# Altium project EmbeddedControlSystem_Hengeveld4331.PrjPcb (part 2 of 2)
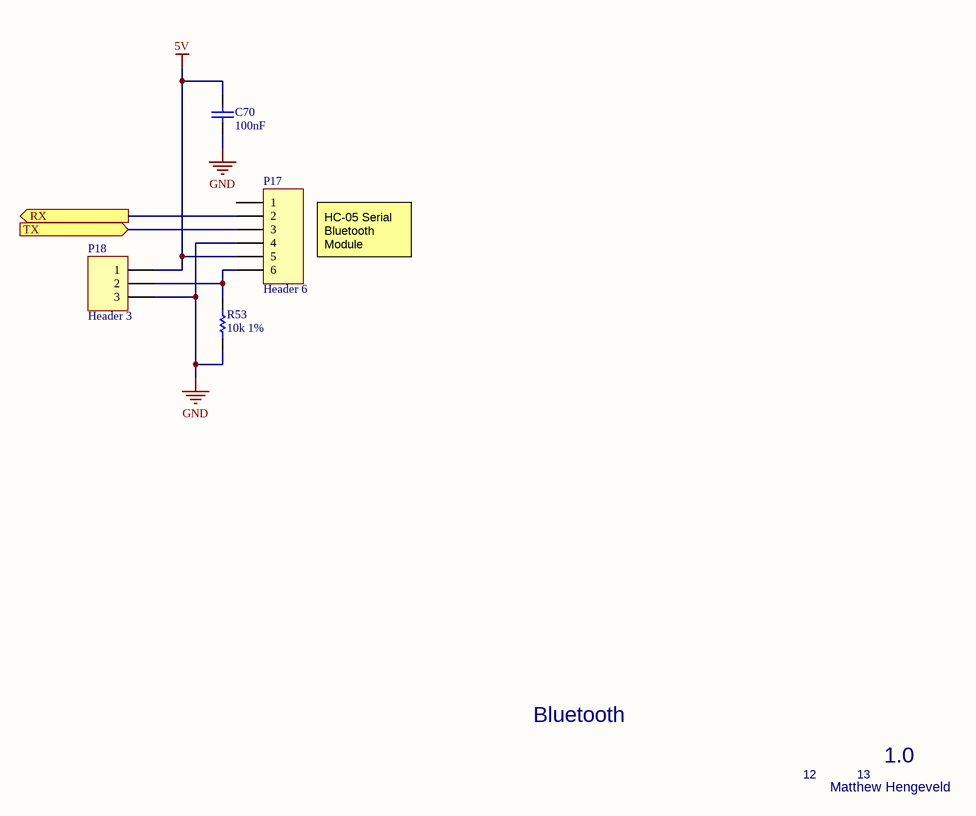
[diagram p13: Bluetooth.SchDoc]

## Nets that join several sheets
3V3: power supply (C21.2 JMP2.1 JMP3.1 U3.4), microcontroller (C2.2 R1.2 R3.1 R4.1), Camera Module (8 pins), DC Motor Driver (11 pins), rs232 (R14.2 R15.2), CANbus (C28.2 U5.5), IO Expansioin (7 pins), Temperature (THM1.2 THM2.2), SD card (C40.2 SD1.4)
5V: power supply (5 pins), microcontroller (C1.2 C4.2 P1.6_1 P2.4), Camera Module (C61.1 C64.1 C65.1 P11.2), LCD (7 pins), rs232 (C22.2 U4.16), CANbus (C27.1 C29.2 P5.2 U5.3), IO Expansioin (C37.2 P6.17 P6.19), Bluetooth (C70.1 P17.5 P18.1)
12V: power supply (9 pins), Camera Module (7 pins), DC Motor Driver (8 pins), TestPoints (TP_1.1 TP_2.1)
AGND: power supply (25 pins), microcontroller (14 pins), Camera Module (28 pins), DC Motor Driver (23 pins), LCD (7 pins), rs232 (5 pins), CANbus (10 pins), IO Expansioin (8 pins), Temperature (C41.1 C42.1 R22.1 R23.1), SD card (C40.1 SD1.6), TestPoints (28 pins), Bluetooth (C70.2 P17.4 P18.3 R53.1)
BL: microcontroller (P1.21_1), LCD (R20.2), TestPoints (R48.3)
DB4: microcontroller (P1.38_1), LCD (LCD1.11), TestPoints (R47.3)
DB5: microcontroller (P1.36_1), LCD (LCD1.12), TestPoints (R47.4)
DB6: microcontroller (P1.35_1), LCD (LCD1.13), TestPoints (R48.1)
DB7: microcontroller (P1.37_1), LCD (LCD1.14), TestPoints (R48.2)
DC_FLT: microcontroller (P1.3_1), DC Motor Driver (MTR1.1 R27.2 U7.18)
DC_RST: microcontroller (P1.1_1), DC Motor Driver (U7.16)
DC_SLP: microcontroller (P1.2_1), DC Motor Driver (U7.17)
E: microcontroller (P1.34_1), LCD (LCD1.6), TestPoints (R47.1)
I2C_SCL: power supply (U3.5), microcontroller (P1.3_2 R3.2), IO Expansioin (P6.1)
I2C_SDA: power supply (U3.6), microcontroller (P1.5_2 R4.2), IO Expansioin (P6.3)
MISO: microcontroller (P1.28_2), IO Expansioin (P6.9 U6.3), SD card (SD1.7)
MOSI: microcontroller (P1.26_2), IO Expansioin (P6.11 U6.2), SD card (SD1.3)
PA0: microcontroller (P1.28_1), rs232 (U4.10)
PA1: microcontroller (P1.30_1), rs232 (U4.9)
PA2: microcontroller (P1.35_2), rs232 (LEDTX1.1 U4.11), Bluetooth (P17.3)
PA3: microcontroller (P1.37_2), rs232 (LEDRX1.1 U4.12), Bluetooth (P17.2)
PA4: microcontroller (P1.32_1), LCD (LCD1.4), TestPoints (R47.2)
PA5: microcontroller (P1.11_2), IO Expansioin (P7.2)
PA6: microcontroller (P1.13_2), Temperature (C42.2 R23.2 THM2.1)
PA7: microcontroller (P1.15_2), Temperature (C41.2 R22.2 THM1.1)
PA8: microcontroller (P1.23_2), DC Motor Driver (U8.6), TestPoints (R49.1)
PA9: microcontroller (P1.21_2), DC Motor Driver (U8.4), TestPoints (R49.2)
PA10: microcontroller (P1.33_2), Camera Module (MTR2.1 R38.2 U9.15)
PA11: microcontroller (P1.14_2), CANbus (U5.4), TestPoints (R51.2)
PA12: microcontroller (P1.12_2), CANbus (U5.1), TestPoints (R51.1)
PA15: microcontroller (P1.17_1), Camera Module (R41.2), TestPoints (R48.4)
PB1: microcontroller (P1.24_2), Camera Module (U10.6), TestPoints (R52.1)
PB2: microcontroller (P1.22_2), Camera Module (U10.4), TestPoints (R52.2)
PB3: microcontroller (P1.31_2), Camera Module (U9.18), TestPoints (R51.4)
PB4: microcontroller (P1.27_2), Camera Module (U9.20), TestPoints (R52.4)
PB5: microcontroller (P1.29_2), Camera Module (U9.19), TestPoints (R52.3)
PB6: microcontroller (P1.17_2), SD card (SD1.2)
PB10: microcontroller (P1.25_2), IO Expansioin (U6.8)
PB11: microcontroller (P1.18_2), CANbus (U5.8)
PB12: microcontroller (P1.16_2), IO Expansioin (U6.7)
PB13: microcontroller (P1.30_2), IO Expansioin (P6.13 U6.1), SD card (SD1.5)
PC4: microcontroller (P1.34_2), Camera Module (U9.17)
PC5: microcontroller (P1.6_2), DC Motor Driver (U7.23), TestPoints (R49.3)
PC6: microcontroller (P1.4_2), DC Motor Driver (U7.20), TestPoints (R49.4)
PC8: microcontroller (P1.2_2), DC Motor Driver (U7.21), TestPoints (R50.1)
PC9: microcontroller (P1.1_2), DC Motor Driver (U7.22), TestPoints (R50.2)
PC13: microcontroller (P1.23_1), IO Expansioin (P6.5)
RESET: microcontroller (P1.14_1), IO Expansioin (5 pins)